# EAGLE design mini-position-sensor (EAGLE 9.3.0)
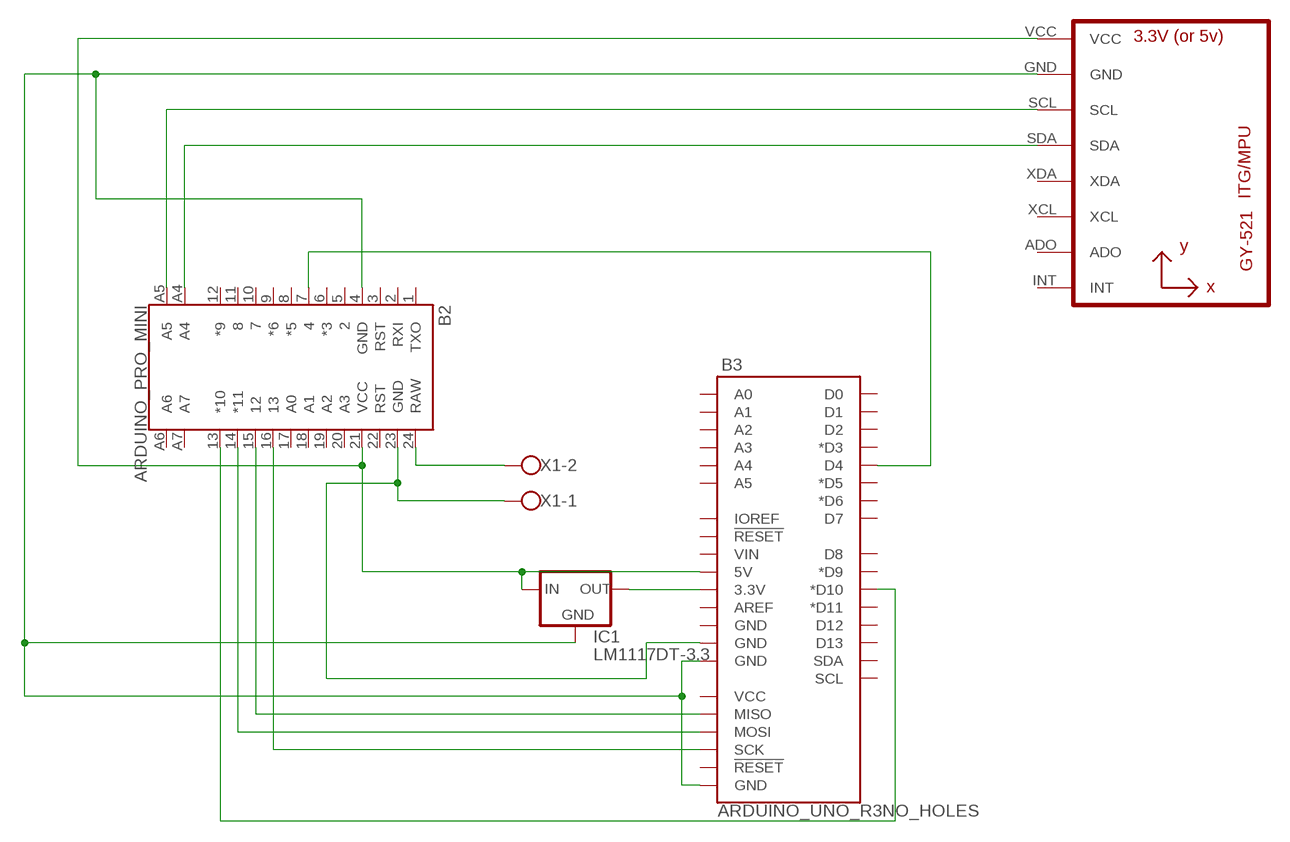
[diagram p0: schematic, sheet 1]

## Parts
B2  ARDUINO_PRO_MINI  [ARDUINO_PRO_MINI]
B3  ARDUINO_UNO_R3NO_HOLES  [ARDUINO_R3_NO_HOLES]
IC1  LM1117DT-3.3  [TO252]
U1  GY-521MPU6050  [GY-521]
X1  W237-102  [W237-102]

## Nets
N$1: B2.7 B3.D4
N$2: B2.4(GND) B3.GND@1(GND) B3.GND@2(GND) IC1.1(GND) U1.GND
N$3: B2.14(*11) B3.MOSI
N$4: B2.15 B3.MISO
N$5: B2.A4 U1.SDA
N$6: B2.A5 U1.SCL
N$7: B3.3.3V IC1.3(OUT)
N$8: B2.24(RAW) X1.2
N$11: B2.16 B3.SCK
N$12: B2.13(*10) B3.D10(*D10)
N$14: B2.23(GND) B3.GND@3(GND) X1.1
N$15: B2.21(VCC) B3.5V IC1.2(IN) U1.VCC
Unconnected: B2.1(TXO) B2.2(RXI) B2.3(RST) B2.5 B2.6(*3) B2.8(*5) B2.9(*6) B2.10 B2.11 B2.12(*9) B2.17(A0) B2.18(A1) B2.19(A2) B2.20(A3) B2.22(RST) B2.A6 B2.A7 B3.A0 B3.A1 B3.A2 B3.A3 B3.A4 B3.A5 B3.AREF B3.D0 B3.D1 B3.D2 B3.D3(*D3) B3.D5(*D5) B3.D6(*D6) B3.D7 B3.D8 B3.D9(*D9) B3.D11(*D11) B3.D12 B3.D13 B3.GND@4(GND) B3.IOREF B3.RESET@1(!RESET!) B3.RESET@2(!RESET!) B3.SCL B3.SDA B3.VCC B3.VIN U1.ADO U1.INT U1.XCL U1.XDA

## Library data of the parts
B2 = SparkFun-Boards:ARDUINO_PRO_MINI: SparkFun Pro Mini Pro Mini compatible footprint. Dimensions: 0.7 x 1.3" PCB Thickness: 0.8mm SparkFun Products: 3.3V/8MHz <https://www.sparkfun.com/products/11114> 5V/16MHz <https://www.sparkfun.com/products/11113>
B3 = proMini:ARDUINO_UNO_R3: Arduino R3 Footprint with SPI header Arduino Uno R3 Compatible Footprint. Matches PCB size of the original board. SparkFun Products: SAMD21 Dev Breakout <https://www.sparkfun.com/products/13672> RedBoard <https://www.sparkfun.com/products/12757> R3 Stackable Headers <https://www.sparkfun.com/products/11417>
IC1 = lm1117_10:LM1117?-*: 800mA Low-Dropout Linear Regulator Source: http://www.ti.com/lit/ds/symlink/lm1117-n.pdf; MF: Texas Instruments; MPN: LM1117DT-3.3; OC_FARNELL: 1469048; OC_NEWARK: 41K3430
U1 = gy-521:GY-521
X1 = con-wago-500:W237-102: WAGO SCREW CLAMP; MPN: 237-102; OC_FARNELL: unknown; OC_NEWARK: 70K9898

## Board
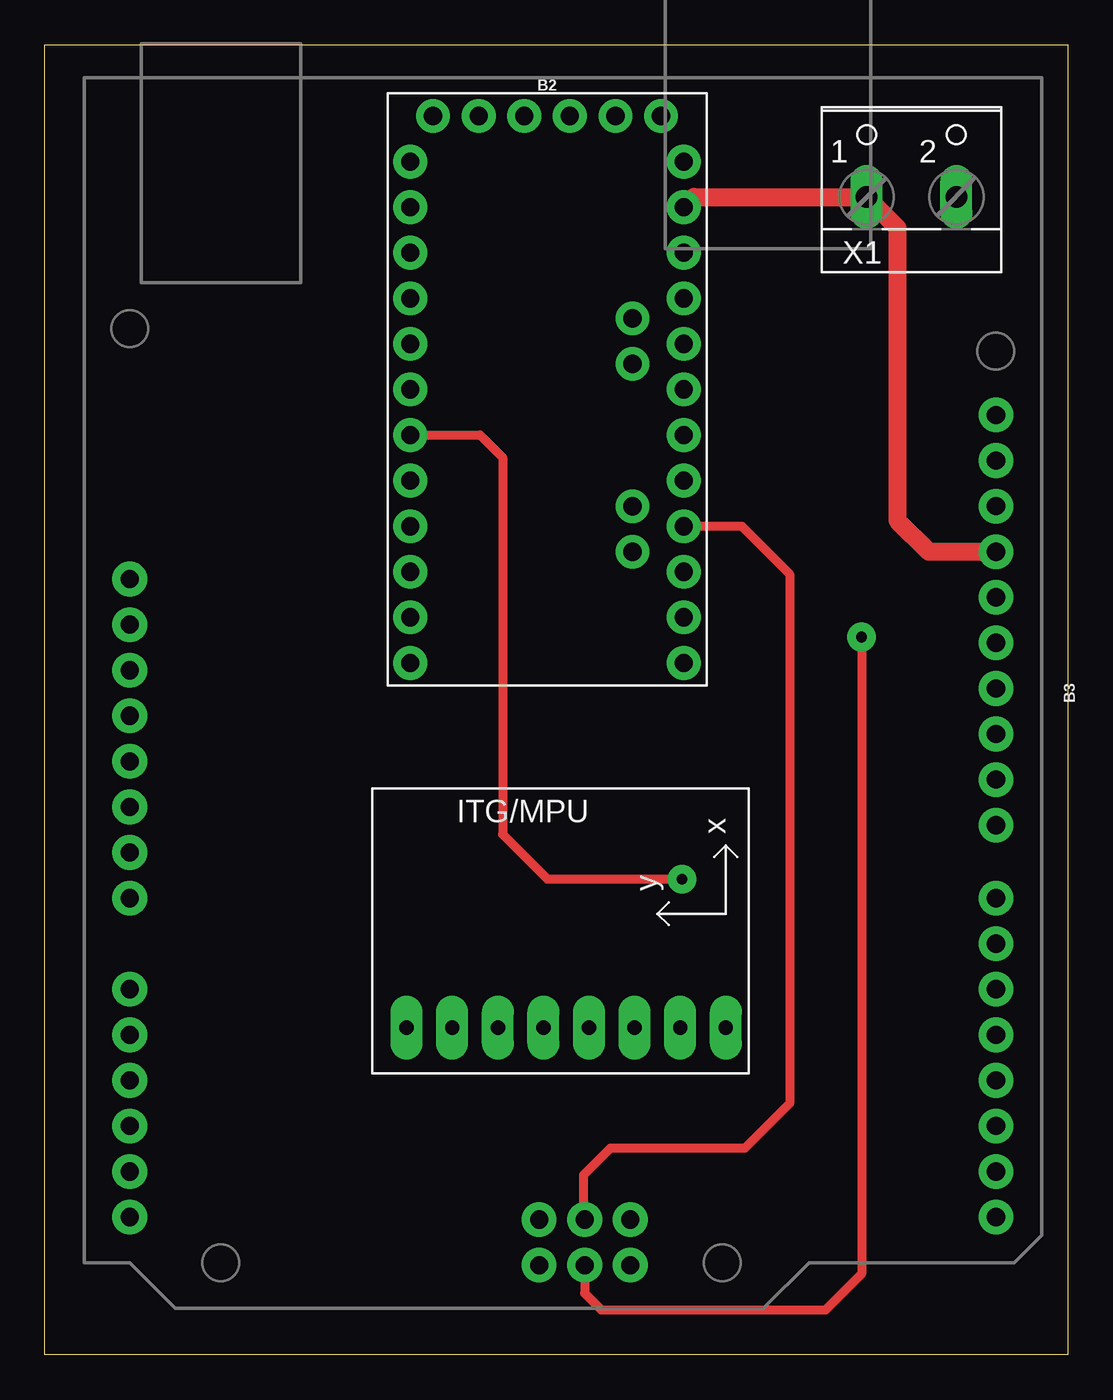
[diagram p1: board, top side]
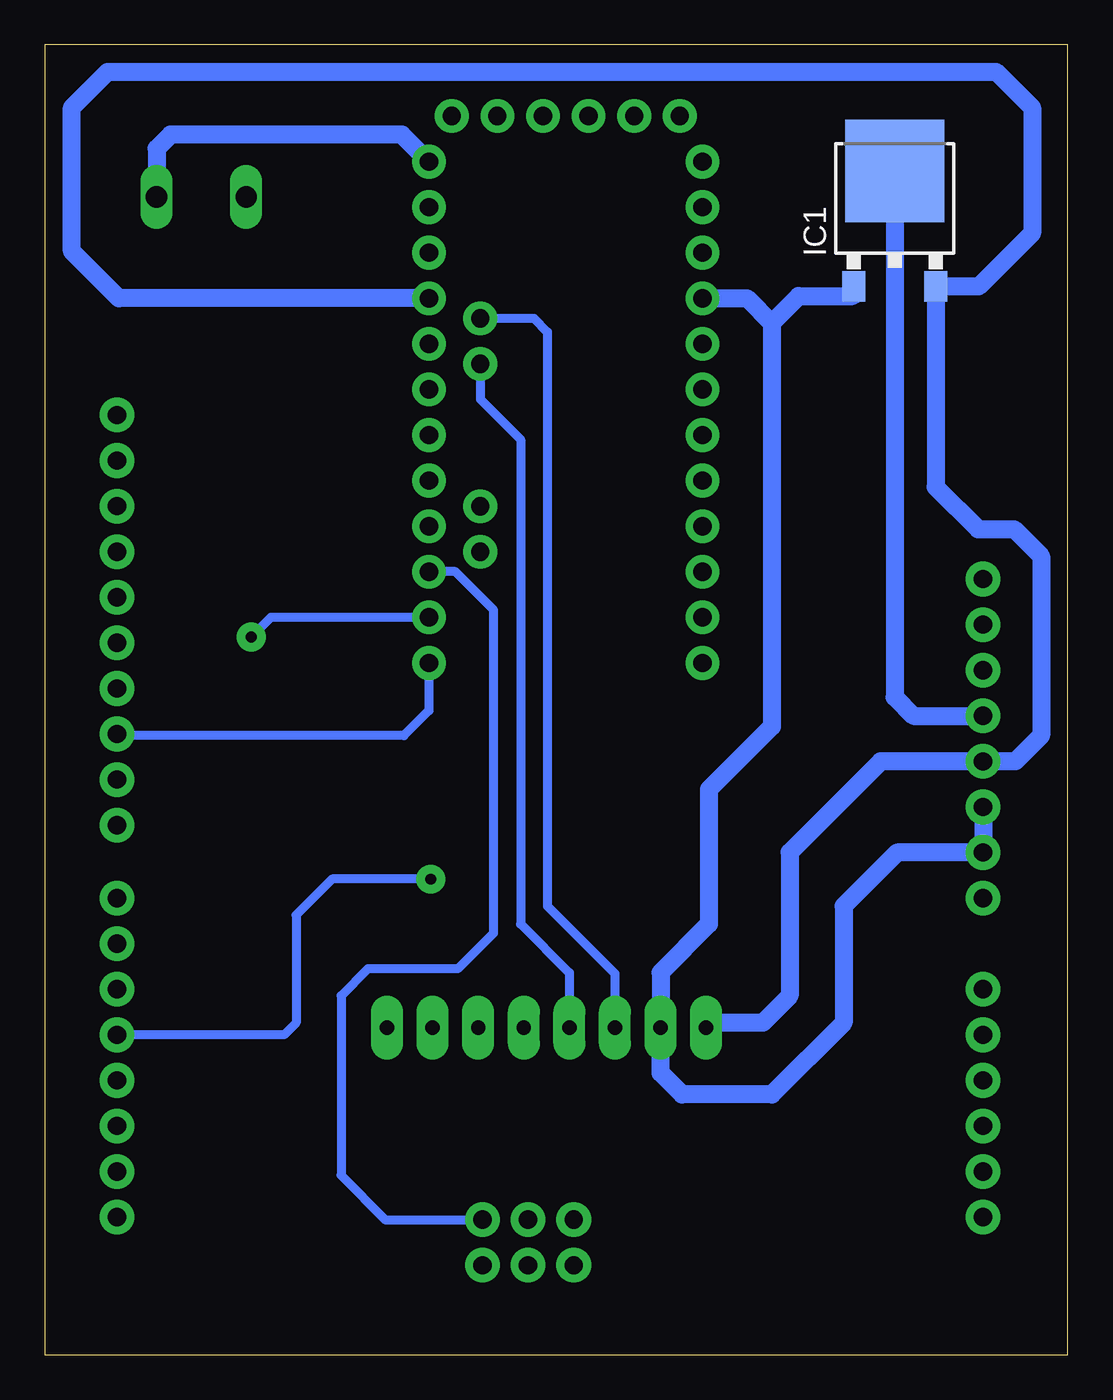
[diagram p2: board, bottom side, seen from below]

Size 57 x 73 mm. Coordinates in mm from the lower left corner, seen from the top.
Outline: 0,73 57,73 57,0 0,0 0,73
Copper layers (1*16): Top 0.018mm / dielectric 1.55mm / Bottom 0.018mm
Design rules "LPKF_GroepT(3)": minimum track width 0.5mm, minimum drill 0.6mm, track to track 0.2mm, track to pad 0.2mm, pad to pad 0.2mm, via to via 0.2mm, smd to smd 0mil, copper to edge 0.25mm, drill to drill 0.35mm, minimum pad ring 0.25mm, minimum via ring 0.5mm, stop-mask expansion 0mil, vias tented up to drill 0.45mm, thermal gap 0.2mm

### Footprints (pad centres in the part's own frame; a part is rotated, then mirrored left to right if it is on the bottom)
ARDUINO_PRO_MINI = drill 1.016 pad 1.88: 1 -7.62,12.7; 2 -7.62,10.16; 3 -7.62,7.62; 4 -7.62,5.08; 5 -7.62,2.54; 6 -7.62,0; 7 -7.62,-2.54; 8 -7.62,-5.08; 9 -7.62,-7.62; 10 -7.62,-10.16; 11 -7.62,-12.7; 12 -7.62,-15.24; 13 7.62,-15.24; 14 7.62,-12.7; 15 7.62,-10.16; 16 7.62,-7.62; 17 7.62,-5.08; 18 7.62,-2.54; 19 7.62,0; 20 7.62,2.54; 21 7.62,5.08; 22 7.62,7.62; 23 7.62,10.16; 24 7.62,12.7; A4 4.763,1.429; A5 4.763,3.969; A6 4.763,-9.049; A7 4.763,-6.509; BLK -6.35,15.24; GND -3.81,15.24; GRN 6.35,15.24; RXI 1.27,15.24; TXO 3.81,15.24; VCC -1.27,15.24
ARDUINO_R3_NO_HOLES = drill 1.016 pad 1.93: 3.3V 1.27,-24.13; 5V 3.81,-24.13; A0 16.51,-24.13; A1 19.05,-24.13; A2 21.59,-24.13; A3 24.13,-24.13; A4 26.67,-24.13; A5 29.21,-24.13; AREF -10.414,24.13; D0 29.21,24.13; D1 26.67,24.13; D2 24.13,24.13; D3 21.59,24.13; D4 19.05,24.13; D5 16.51,24.13; D6 13.97,24.13; D7 11.43,24.13; D8 7.366,24.13; D9 4.826,24.13; D10 2.286,24.13; D11 -0.254,24.13; D12 -2.794,24.13; D13 -5.334,24.13; GND@1 6.35,-24.13; GND@2 8.89,-24.13; GND@3 -7.874,24.13; GND@4 31.89,-1.32; IOREF -3.81,-24.13; MISO 29.35,3.76; MOSI 31.89,1.22; NC -6.35,-24.13; RESET@1 -1.27,-24.13; RESET@2 29.35,-1.32; SCK 29.35,1.22; SCL -15.494,24.13; SDA -12.954,24.13; VCC 31.89,3.76; VIN 11.43,-24.13
TO252 = smd 1.3 x 1.7: 1 -2.285,-4.22; 2 2.285,-4.22 | smd 5.5 x 5.7: 3 0,2.22
GY-521 = drill 0.8 pad 1.778 long: ADO -8.89,-6.35; GND -8.89,6.35; INT -8.89,-8.89; SCL -8.89,3.81; SDA -8.89,1.27; VCC -8.89,8.89; XCL -8.89,-3.81; XDA -8.89,-1.27
W237-102 = drill 1.194 long: 1 -2.5,-1.27; 2 2.5,-1.27

### Placement (x,y rotation side)
B2  27.98,53.79 0 top
B3  28.86,36.88 270 top
IC1  9.65,63.75 0 bottom
U1  29.05,27.11 90 top
X1  48.28,65.79 0 top

### Tracks (layer width: path | path; a pad name or v marks a point on that pad's centre or on a via)
N$1  (via drill 0.6)
  Top 0.5: B2.7 24.25,51.25 25.5,50 25.5,29 28,26.5 v35.5,26.5
  Bottom 0.5: B3.D4 43.67,17.83 43,18.5 43,24.5 41,26.5 v35.5,26.5
N$2
  Bottom 1: B3.GND@1 B3.GND@2 9.51,27.99 12.5,25 12.5,18.5 16.5,14.5 21.5,14.5 22.7,15.7 U1.GND 22.7,21.3 20,24 20,31.5 16.5,35 16.5,57.5 | B2.4 17.87,58.87 16.5,57.5 | 16.5,57.5 15,59 12,59 11.94,59.06 IC1.1
N$3  (via drill 0.6)
  Top 0.5: v45.5,40 45.5,4.5 43.5,2.5 31,2.5 30.08,3.42 B3.MOSI
  Bottom 0.5: B2.14 44.41,41.09 45,40.5 arc60 v45.5,40
N$4
  Bottom 0.5: B3.MISO 32.64,7.5 38,7.5 40.5,10 40.5,20 39,21.5 34,21.5 32,23.5 32,41.5 34.13,43.63 B2.15
N$5
  Bottom 0.5: B2.A4 32.74,53.24 30.5,51 30.5,24 27.78,21.28 U1.SDA
N$6
  Bottom 0.5: U1.SCL 25.24,21.24 29,25 29,52 29,52.5 29,57 29.76,57.76 B2.A5
N$7
  Bottom 1: IC1.3 9.65,36.65 8.61,35.61 B3.3.3V
N$8
  Bottom 1: X1.2 50.78,67.22 50,68 44.5,68 44,68 37.11,68 B2.24
N$11
  Top 0.5: B2.16 38.83,46.17 41.5,43.5 41.5,14 39,11.5 31.5,11.5 30,10 30,7.6 B3.SCK
N$12
  Bottom 0.5: B2.13 35.6,35.9 37,34.5 52.9,34.5 B3.D10
N$14
  Top 1: B3.GND@3 49.25,44.75 47.5,46.5 47.5,62.8 X1.1 36.17,64.52 B2.23
N$15
  Bottom 1: U1.VCC 19.88,18.5 17,18.5 15.5,20 15.5,28 10.43,33.07 B3.5V 2.93,33.07 1.5,34.5 1.5,44.5 3,46 5,46 7.37,48.37 IC1.2 4.97,59.53 2,62.5 2,69.5 4,71.5 53.5,71.5 55.5,69.5 55.5,61.5 52.87,58.87 B2.21